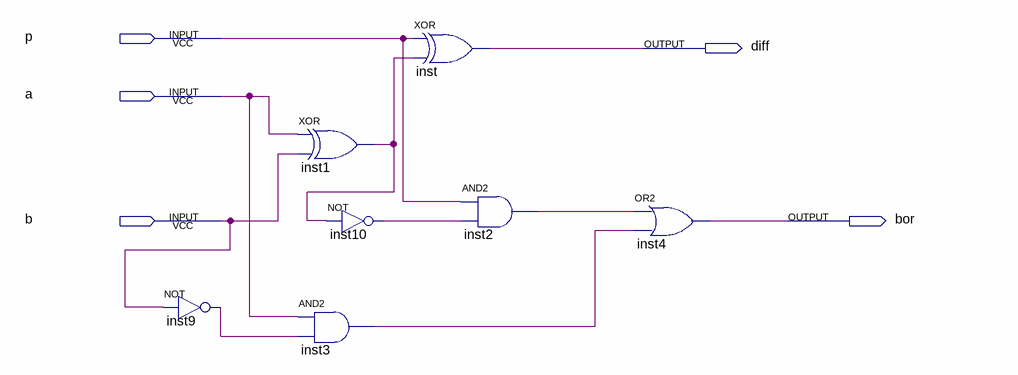
[diagram p0: schematic sheet]
// Quartus schematic one_digit_sub.bdf as structural Verilog: 7 symbols, 5 pins
module one_digit_sub (
  input  p,
  input  a,
  input  b,
  output diff,
  output bor
);

  wire inst1_out, inst2_out, inst3_out, inst9_out, inst10_out;

  not inst9 (inst9_out, b);
  xor inst1 (inst1_out, a, b);
  not inst10 (inst10_out, inst1_out);
  and inst3 (inst3_out, a, inst9_out);
  xor inst (diff, p, inst1_out);
  and inst2 (inst2_out, p, inst10_out);
  or inst4 (bor, inst2_out, inst3_out);
endmodule
